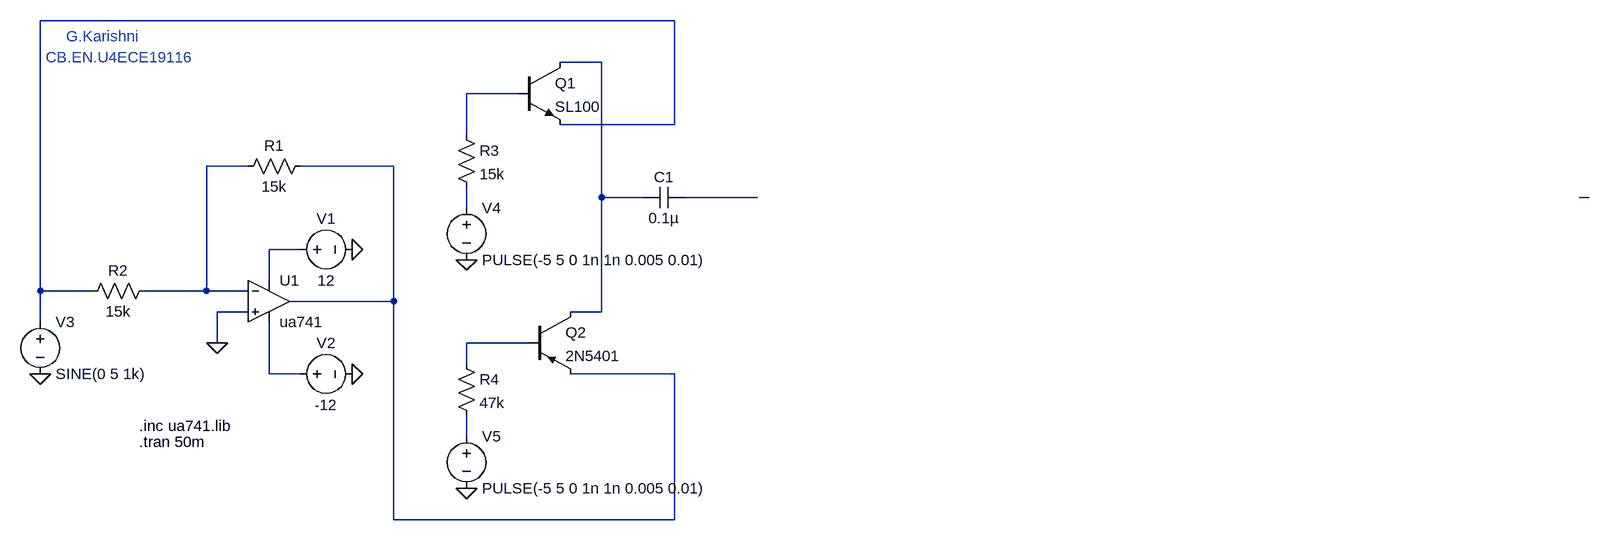
[diagram p0: schematic Draft_modulation.asc]
Draft_modulation.asc, the LTspice schematic file:
Version 4
SHEET 1 2200 680
WIRE 768 -272 -208 -272
WIRE 656 -208 592 -208
WIRE 528 -160 448 -160
WIRE 768 -112 768 -272
WIRE 768 -112 592 -112
WIRE 448 -96 448 -160
WIRE 112 -48 48 -48
WIRE 336 -48 192 -48
WIRE 656 0 656 -208
WIRE 720 0 656 0
WIRE 896 0 784 0
WIRE 2176 0 2160 0
WIRE 448 16 448 -16
WIRE 192 80 144 80
WIRE 144 128 144 80
WIRE -208 144 -208 -272
WIRE -128 144 -208 144
WIRE 48 144 48 -48
WIRE 48 144 -48 144
WIRE 112 144 48 144
WIRE 336 160 336 -48
WIRE 336 160 176 160
WIRE 112 176 64 176
WIRE 656 176 656 0
WIRE 656 176 608 176
WIRE -208 192 -208 144
WIRE 64 224 64 176
WIRE 544 224 448 224
WIRE 448 256 448 224
WIRE 144 272 144 192
WIRE 192 272 144 272
WIRE 768 272 608 272
WIRE 448 368 448 336
WIRE 336 496 336 160
WIRE 768 496 768 272
WIRE 768 496 336 496
FLAG 272 80 0
FLAG 272 272 0
FLAG 64 224 0
FLAG -208 272 0
FLAG 448 96 0
FLAG 448 448 0
SYMBOL OpAmps\\ua741 144 96 R0
SYMATTR InstName U1
SYMBOL voltage 176 80 R270
WINDOW 0 32 56 VTop 2
WINDOW 3 -32 56 VBottom 2
WINDOW 123 0 0 Left 0
WINDOW 39 0 0 Left 0
SYMATTR InstName V1
SYMATTR Value 12
SYMBOL voltage 176 272 R270
WINDOW 0 32 56 VTop 2
WINDOW 3 -32 56 VBottom 2
WINDOW 123 0 0 Left 0
WINDOW 39 0 0 Left 0
SYMATTR InstName V2
SYMATTR Value -12
SYMBOL res 208 -64 R90
WINDOW 0 0 56 VBottom 2
WINDOW 3 32 56 VTop 2
SYMATTR InstName R1
SYMATTR Value 15k
SYMBOL res -32 128 R90
WINDOW 0 0 56 VBottom 2
WINDOW 3 32 56 VTop 2
SYMATTR InstName R2
SYMATTR Value 15k
SYMBOL voltage -208 176 R0
WINDOW 123 0 0 Left 0
WINDOW 39 0 0 Left 0
SYMATTR InstName V3
SYMATTR Value SINE(0 5 1k)
SYMBOL npn 528 -208 R0
SYMATTR InstName Q1
SYMATTR Value SL100
SYMBOL res 432 -112 R0
SYMATTR InstName R3
SYMATTR Value 15k
SYMBOL voltage 448 0 R0
WINDOW 123 0 0 Left 0
WINDOW 39 0 0 Left 0
SYMATTR InstName V4
SYMATTR Value PULSE(-5 5 0 1n 1n 0.005 0.01)
SYMBOL pnp 544 176 R0
SYMATTR InstName Q2
SYMATTR Value 2N5401
SYMBOL res 432 240 R0
SYMATTR InstName R4
SYMATTR Value 47k
SYMBOL voltage 448 352 R0
WINDOW 123 0 0 Left 0
WINDOW 39 0 0 Left 0
SYMATTR InstName V5
SYMATTR Value PULSE(-5 5 0 1n 1n 0.005 0.01)
SYMBOL cap 784 -16 R90
WINDOW 0 0 32 VBottom 2
WINDOW 3 32 32 VTop 2
SYMATTR InstName C1
SYMATTR Value 0.1µ
TEXT -56 352 Left 2 !.inc ua741.lib
TEXT -56 376 Left 2 !.tran 50m
TEXT -168 -248 Left 2 ;G.Karishni
TEXT -200 -216 Left 2 ;CB.EN.U4ECE19116

The netlist it stands for:
* Draft_modulation.asc
XU1 0 N004 N009 N011 N005 ua741  ; pins In+ In- V+ V- OUT
V1 N009 0 12
V2 N011 0 -12
R1 N005 N004 15k
R2 N004 N001 15k
V3 N001 0 SINE(0 5 1k)
Q1 N002 N003 N001 0 SL100
R3 N003 N008 15k
V4 N008 0 PULSE(-5 5 0 1n 1n 0.005 0.01)
Q2 N002 N010 N005 0 2N5401
R4 N010 N012 47k
V5 N012 0 PULSE(-5 5 0 1n 1n 0.005 0.01)
C1 N006 N002 0.1µ
.model NPN NPN
.model PNP PNP
.lib standard.bjt
.inc ua741.lib
.tran 50m
* G.Karishni
* CB.EN.U4ECE19116
.backanno
.end